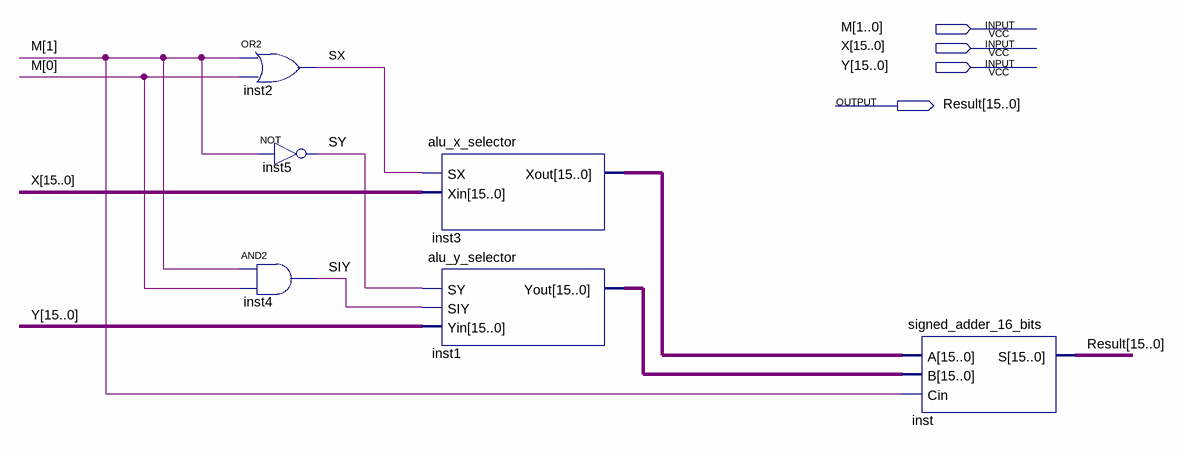
[diagram p0: schematic sheet]
// Quartus schematic alu.bdf as structural Verilog: 6 symbols, 4 pins
module alu (
  input  [1:0] M,
  input  [15:0] X,
  input  [15:0] Y,
  output [15:0] Result
);

  wire SIY, SX, SY;
  wire [15:0] inst1_yout, inst3_xout;

  or inst2 (SX, M[1], M[0]);
  not inst5 (SY, M[1]);
  and inst4 (SIY, M[1], M[0]);
  alu_x_selector inst3 (.SX(SX), .Xin(X), .Xout(inst3_xout));
  alu_y_selector inst1 (.SY(SY), .SIY(SIY), .Yin(Y), .Yout(inst1_yout));
  signed_adder_16_bits inst (.A(inst3_xout), .B(inst1_yout), .Cin(M[1]), .S(Result));
endmodule
